# EAGLE design step-up (EAGLE 5.06)
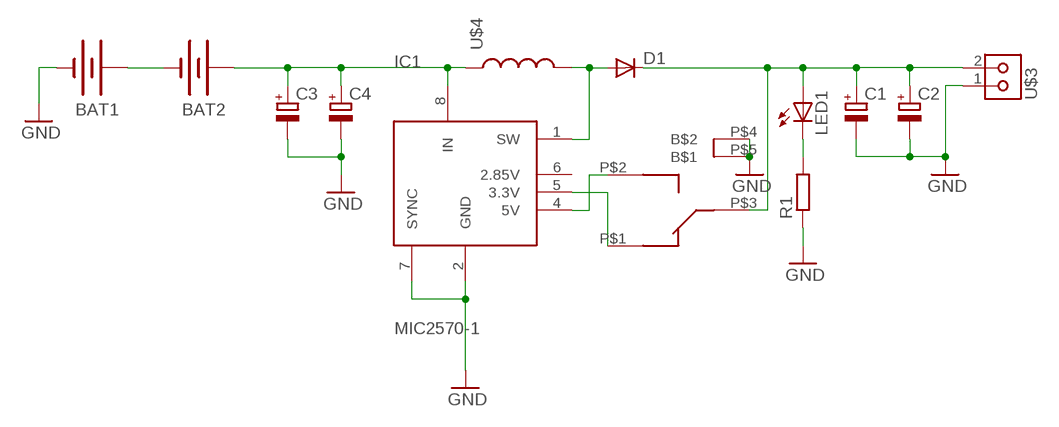
[diagram p0: schematic, sheet 1]

## Parts
BAT1  BATTERYAAA  [BATTERY-AAA]
BAT2  BATTERYAAA  [BATTERY-AAA]
C1  CPOL-EUE2.5-6  [E2,5-6]
C2  CPOL-EUE2.5-6  [E2,5-6]
C3  CPOL-EUE2.5-6  [E2,5-6]
C4  CPOL-EUE2.5-6  [E2,5-6]
D1  DIODE-DO214AA  [DO214AA]
LED1  LED0603  [LED-0603]
R1  R-EU_R0603  [R0603]
U$1  MIC2570-1SO08  [SO08]
U$2  SMDSWITCHCSS-1210TB  [CSS-1210TB]
U$3  KK2V  [KK-V-2]
U$4  INDUCTOR  [ELL6PG]

## Nets
5V: U$1.5(3.3V) U$2.P$1(P1)
GND: BAT1.GND@1(-) C1.- C2.- C3.- C4.- R1.1 U$1.2(GND) U$1.7(SYNC) U$2.P$4(B$2) U$2.P$5(B$1) U$3.1
N$1: BAT1.PWR@1(+) BAT2.GND@1(-)
N$2: U$1.4(5V) U$2.P$2(P2)
N$3: BAT2.PWR@1(+) C3.+ C4.+ U$1.8(IN) U$4.P$1
N$5: D1.A U$1.1(SW) U$4.P$2
N$8: C1.+ C2.+ D1.C LED1.A U$2.P$3(C) U$3.2
N$9: LED1.C R1.2
Unconnected: U$1.6(2.85V)

## Library data of the parts
BAT1 BAT2 = SparkFun:BATTERY: Battery Holders Various common sizes : AA, AAA, 20mm coin cell and 12mm coin cell.
C1-C4 = rcl:CPOL-EU: POLARIZED CAPACITOR, European symbol
D1 = diode:DIODE-: DIODE
LED1 = SparkFun:LED: LEDs Standard schematic elements and footprints for 5mm, 3mm, 1206, and 0603 sized LEDs. 5mm - Spark Fun Electronics SKU : COM-00529 (and others)
R1 = rcl:R-EU_: RESISTOR, European symbol
U$1 = additional:MIC2570-1
U$2 = additional:SMDSWITCH: C&K Components AYZ0102AGRLC
U$3 = molex-kk:KK2*: Molex KK 2-pin connector, 100 mil pin spacing
U$4 = additional:INDUCTOR: Inductors Basic Inductor/Choke - 0603 and 1206. Footprints are not proven and vary greatly between part numbers.

## Board
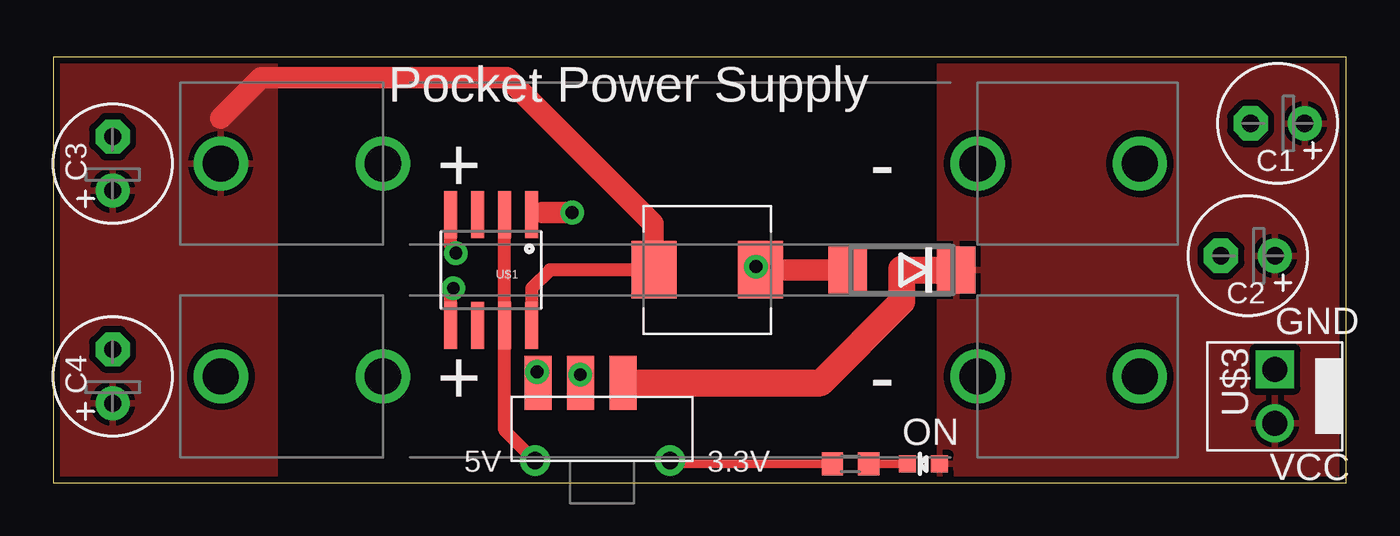
[diagram p1: board, top side]
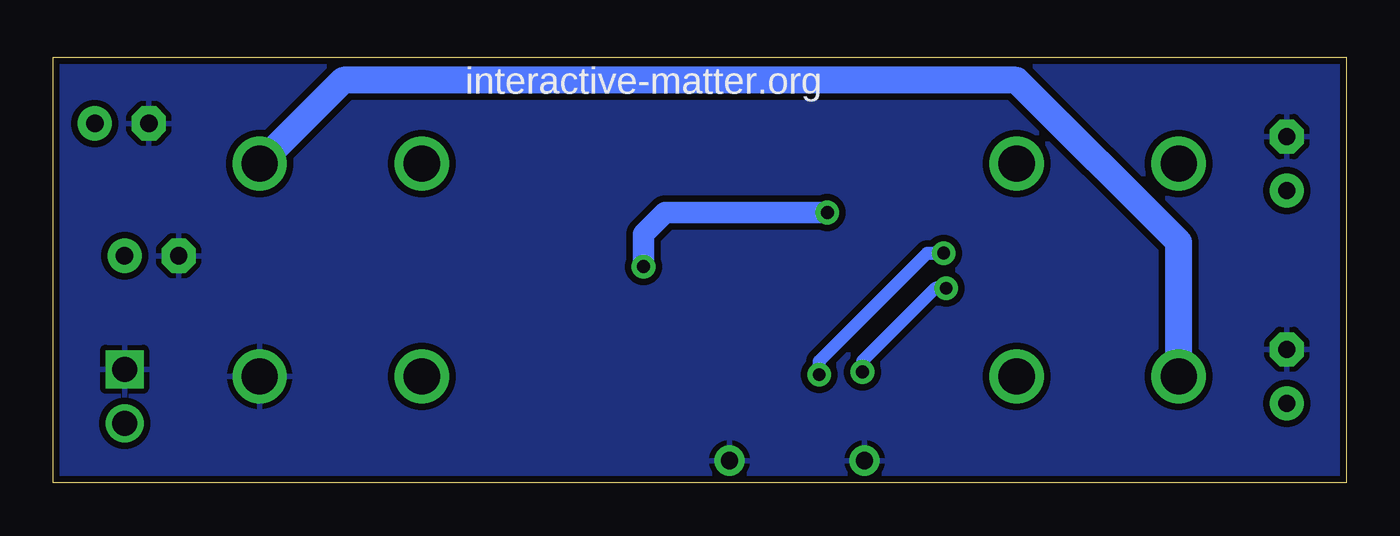
[diagram p2: board, bottom side, seen from below]

Size 60.76 x 20 mm. Coordinates in mm from the lower left corner, seen from the top.
Outline: 0,0 60.76,0 60.76,20 0,20 0,0
Copper layers (1*16): Top 0.035mm / dielectric 1.5mm / Bottom 0.035mm
Design rules "SparkFun": minimum track width 8mil, minimum drill 20mil, track to track 8mil, track to pad 8mil, pad to pad 8mil, via to via 8mil, smd to smd 0mil, copper to edge 10mil, drill to drill 8mil, minimum pad ring 12mil, minimum via ring 10mil, stop-mask expansion 4mil, vias tented up to drill 25mil, thermal gap 10mil

### Footprints (pad centres in the part's own frame; a part is rotated, then mirrored left to right if it is on the bottom)
BATTERY-AAA = drill 1.702 round: GND@1 21.59,0; GND@2 13.97,0; PWR@1 -21.59,0; PWR@2 -13.97,0
E2,5-6 = drill 0.813 pad 1.6 round: + -1.27,0 | drill 0.813 pad 1.6 octagon: - 1.27,0
DO214AA = smd 1.8 x 2.2: A 2.55,0; C -2.55,0
LED-0603 = smd 0.8 x 0.8: A 0,-0.75; C 0,0.75
R0603 = smd 1 x 1.1: 1 -0.85,0; 2 0.85,0
SO08 = smd 0.61 x 2.21: 1 -1.905,-2.616; 2 -0.635,-2.616; 3 0.635,-2.616; 4 1.905,-2.616; 5 1.905,2.616; 6 0.635,2.616; 7 -0.635,2.616; 8 -1.905,2.616
CSS-1210TB = smd 1.27 x 2.54: P$1 -3,2.15; P$2 -1,2.15; P$3 1,2.15 | drill 0.8 round: P$4 -3.15,-1.5; P$5 3.2,-1.5
KK-V-2 = drill 1.168 square: 1 0,1.27 | drill 1.168 round: 2 0,-1.27
ELL6PG = smd 2.1 x 2.7: P$1 -2.5,0; P$2 2.5,0

### Placement (x,y rotation side)
BAT1  29.46,5 0 top
BAT2  29.46,15 0 top
C1  57.53,16.89 180 top
C2  56.13,10.67 180 top
C3  2.79,15 90 top
C4  2.79,5 90 top
D1  39.88,10 180 top
LED1  40.89,0.89 90 top
R1  37.46,0.89 0 top
U$1  20.57,10 180 top
U$2  25.78,2.54 0 top
U$3  57.4,4.06 0 top
U$4  30.73,10 0 top

### Tracks (layer width: path | path; a pad name or v marks a point on that pad's centre or on a via)
5V  (via drill 0.6)
  Top 0.61: U$2.P$1 22.78,4.91 22.73,4.95 v22.73,5.21 | v18.8,9.14 18.67,8.78 U$1.5
  Bottom 0.61: v22.73,5.21 22.73,5.71 19.3,9.14 v18.8,9.14
GND
  Top 0.406: R1.1 28.98,0.89 U$2.P$5
  Top 0.61: U$1.2 U$1.7 21.21,2.46 U$2.P$4
  pour Bottom (isolate 0.305): -2.03,20.7 68.71,20.95 68.83,-2.29 -2.29,-2.29
N$1
  Bottom 1.27: BAT1.PWR@1 7.87,11.3 15.49,18.92 47.13,18.92 BAT2.GND@1
N$2  (via drill 0.6)
  Top 0.61: U$2.P$2 24.78,5.06 v24.77,5.08 | v18.92,10.79 18.92,10.92 18.67,11.18 U$1.4
  Bottom 0.61: v24.77,5.08 24.77,5.71 19.69,10.79 v18.92,10.79
N$3
  Top 0.61: U$4.P$1 23.34,10 22.48,9.14 U$1.8
  Top 1.016: 7.87,17.14 9.78,19.05 21.34,19.05 28.19,12.19 28.19,10.04 U$4.P$1
  pour Top (isolate 0.305): -0.25,21.72 10.41,21.72 10.41,-1.27 -0.51,-0.51 -0.51,-0.25
N$5  (via drill 0.6)
  Top 0.61: 22.99,12.7 22.56,12.7 U$1.1
  Top 1.016: D1.A U$4.P$2 33.18,10 v33.02,10.16 | 22.99,12.7 v24.38,12.7
  Bottom 1.016: v33.02,10.16 33.02,11.68 32,12.7 v24.38,12.7
N$8
  Top 1.016: D1.C
  Top 1.27: D1.C 39.92,9.99 39.88,10.03 39.88,8.51 36.07,4.7 U$2.P$3
  pour Top (isolate 0.305): 41.66,21.21 66.8,20.83 66.8,-1.02 41.66,-0.64
N$9
  Top 0.406: R1.2 LED1.C

### Text on the board
tNames: Pocket Power Supply | GND | ON | 5V | 3.3V | VCC
bNames: interactive-matter.org